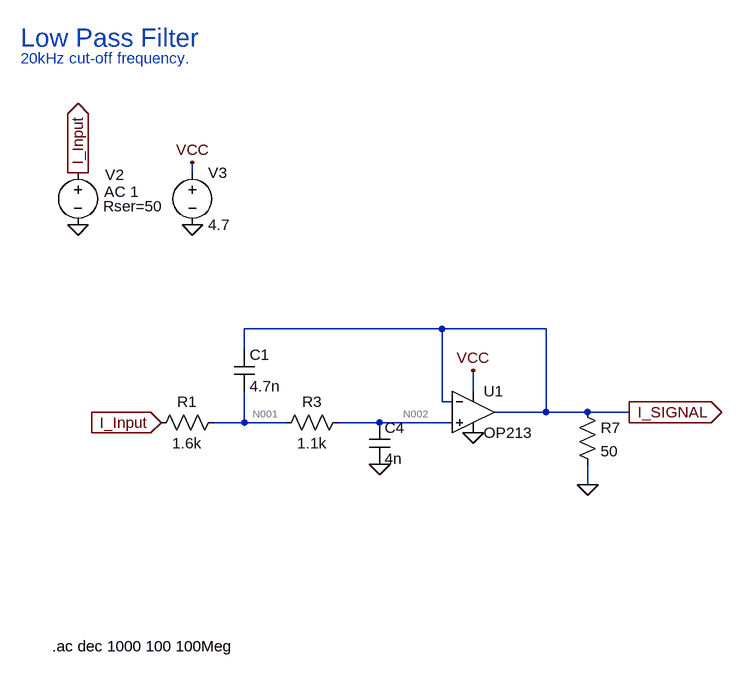
[diagram p0: schematic LP_filter.asc]
LP_filter.asc, the LTspice schematic file:
Version 4.1
SHEET 1 1076 680
WIRE 96 -256 96 -272
WIRE 480 -16 176 -16
WIRE 640 -16 480 -16
WIRE 176 16 176 -16
WIRE 528 80 528 48
WIRE 480 96 480 -16
WIRE 496 96 480 96
WIRE 640 112 640 -16
WIRE 640 112 560 112
WIRE 704 112 640 112
WIRE 768 112 704 112
WIRE 176 128 176 80
WIRE 176 128 128 128
WIRE 240 128 176 128
WIRE 384 128 320 128
WIRE 496 128 384 128
WIRE 704 224 704 192
FLAG 384 192 0
FLAG -80 -176 0
FLAG -80 -256 I_Input
IOPIN -80 -256 Out
FLAG 48 128 I_Input
IOPIN 48 128 In
FLAG 96 -176 0
FLAG 96 -272 VCC
FLAG 528 48 VCC
FLAG 528 144 0
FLAG 768 112 I_SIGNAL
IOPIN 768 112 Out
FLAG 704 224 0
SYMBOL res 144 112 R90
WINDOW 0 0 56 VBottom 2
WINDOW 3 32 56 VTop 2
SYMATTR InstName R1
SYMATTR Value 1.6k
SYMBOL res 336 112 R90
WINDOW 0 0 56 VBottom 2
WINDOW 3 32 56 VTop 2
SYMATTR InstName R3
SYMATTR Value 1.1k
SYMBOL cap 160 16 R0
SYMATTR InstName C1
SYMATTR Value 4.7n
SYMBOL cap 368 128 R0
SYMATTR InstName C4
SYMATTR Value 4n
SYMBOL voltage -80 -272 R0
WINDOW 123 40 45 Left 2
WINDOW 39 39 67 Left 2
WINDOW 0 42 19 Left 2
SYMATTR Value2 AC 1
SYMATTR SpiceLine Rser=50
SYMATTR InstName V2
SYMATTR Value ""
SYMBOL voltage 96 -272 R0
WINDOW 123 0 0 Left 0
WINDOW 39 0 0 Left 0
SYMATTR InstName V3
SYMATTR Value 4.7
SYMBOL res 688 96 R0
SYMATTR InstName R7
SYMATTR Value 50
SYMBOL OpAmps\\OP213 528 48 R0
SYMATTR InstName U1
TEXT -120 472 Left 2 !.ac dec 1000 100 100Meg
TEXT -168 -464 Left 4 ;Low Pass Filter
TEXT -168 -432 Left 2 ;20kHz cut-off frequency.

The netlist it stands for:
* LP_filter.asc
R1 N001 I_Input 1.6k
R3 N002 N001 1.1k
C1 I_SIGNAL N001 4.7n
C4 N002 0 4n
V2 I_Input 0 AC 1 Rser=50
V3 VCC 0 4.7
R7 I_SIGNAL 0 50
X§U1 N002 I_SIGNAL VCC 0 I_SIGNAL OP213  ; pins In+ In- V+ V- OUT
.ac dec 1000 100 100Meg
* Low Pass Filter
* 20kHz cut-off frequency.
.backanno
.end

* Results of the author's LTspice run, read from the files saved beside the schematic
* Operating Point, zero values left out:
*   V(i_input) = 13.24 µV
*   V(i_signal) = 711.9 µV
*   V(n001) = 437 µV
*   V(n002) = 728.3 µV
*   V(vcc) = 4.7 V
*   I(R1) = 264.8 nA
*   I(R3) = 264.8 nA
*   I(R7) = 14.24 µA
*   I(V2) = 264.8 nA
*   I(V3) = -771.8 µA
*   Ix(u1:2) = -214.8 nA
*   Ix(u1:3) = -264.8 nA
*   Ix(u1:4) = -757.3 µA
*   Ix(u1:6) = -14.02 µA
*   Ix(u1:7) = 771.8 µA
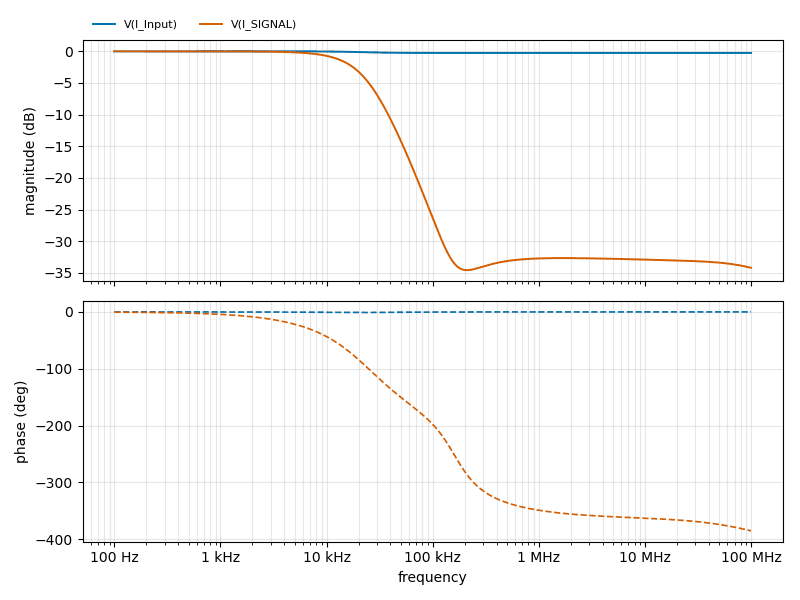
[diagram p1: AC Analysis of LP_filter.asc, plotted from the saved traces]
* AC Analysis, 1 run:
*   V(I_Input): -0.00 dB at 100 Hz, -0.26 dB at 100 MHz, peak -0.00 dB at 100 Hz
*   V(I_SIGNAL): -0.00 dB at 100 Hz, -34.19 dB at 100 MHz, peak -0.00 dB at 100 Hz, 3 dB below the peak at 19.36 kHz